# Altium project Brd_4_Sensor_Shield.PrjPcb
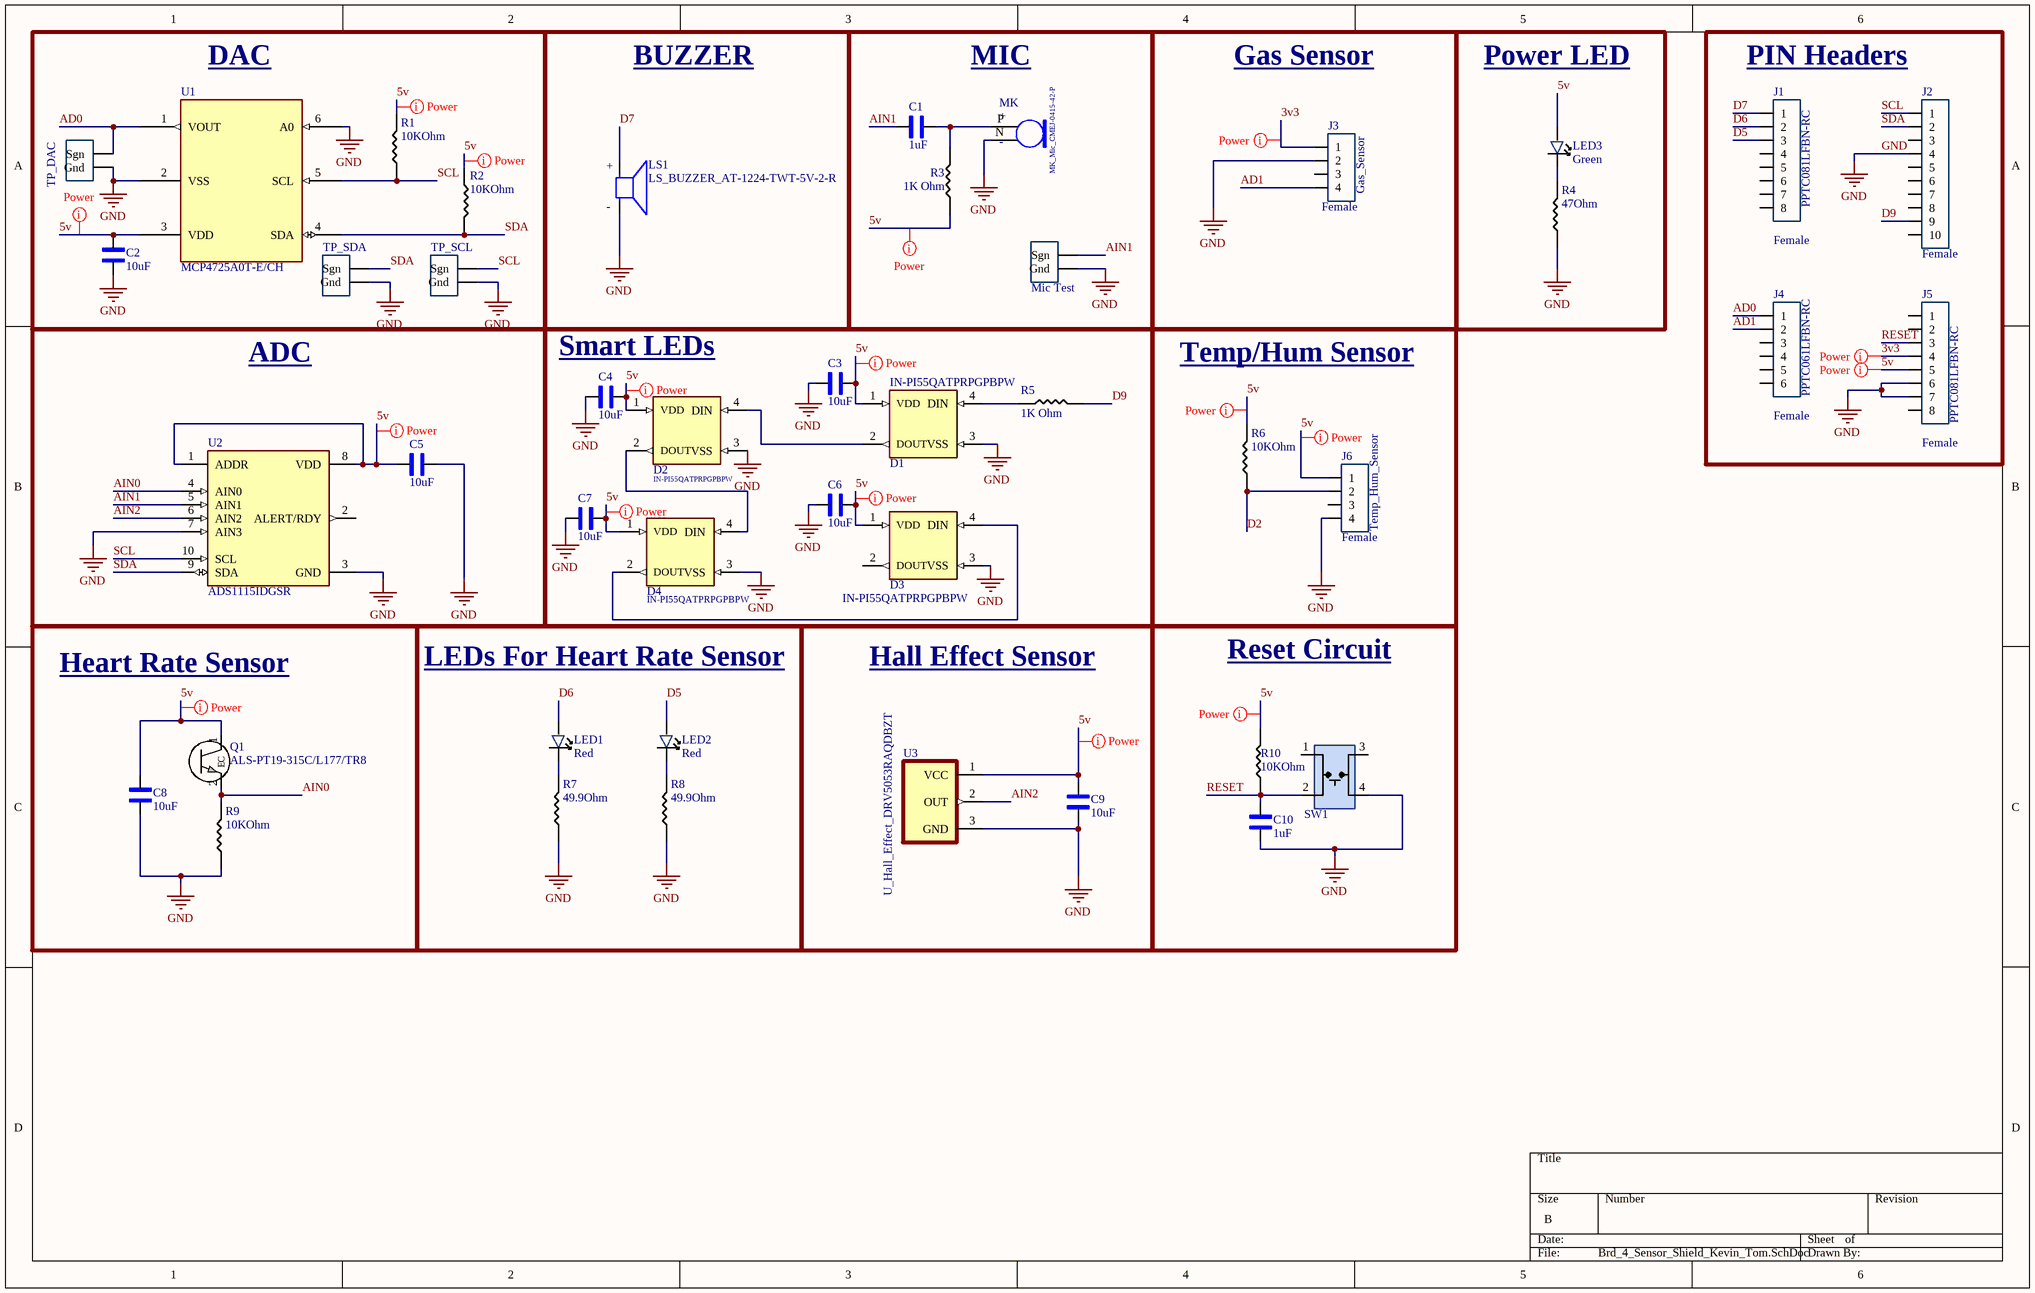
[diagram p0: Brd_4_Sensor_Shield_Kevin_Tom.SchDoc]
1 sheet, 44 parts. Net scope: global (net labels, ports and power ports of the same name join across sheets).
Board file: Brd_4_Sensor_Shield_Kevin_Tom.PcbDoc

## Sheet Brd_4_Sensor_Shield_Kevin_Tom.SchDoc
size B; SheetNumber: 1; SheetTotal: 1

### Parts
C1  1uF  [1206_Passive_Capacitor]
C2  10uF  [1206_Passive_Capacitor]
C3  10uF  [1206_Passive_Capacitor]
C4  10uF  [1206_Passive_Capacitor]
C5  10uF  [1206_Passive_Capacitor]
C6  10uF  [1206_Passive_Capacitor]
C7  10uF  [1206_Passive_Capacitor]
C8  10uF  [1206_Passive_Capacitor]
C9  10uF  [1206_Passive_Capacitor]
C10  1uF  [1206_Passive_Capacitor]
D1  IN-PI55QATPRPGPBPW  [SERIAL_LED]
D2  IN-PI55QATPRPGPBPW  [SERIAL_LED]
D3  IN-PI55QATPRPGPBPW  [SERIAL_LED]
D4  IN-PI55QATPRPGPBPW  [SERIAL_LED]
J1  PPTC081LFBN-RC  value Female  [8_PIN_ARDUINO_100MIL]
J2  value Female  [10_PIN_ARDUINO_100MIL]  (hidden comment: PPTC101LFBN-RC)
J3  Gas_Sensor  value Female  [4_PIN_100MIL]
J4  PPTC061LFBN-RC  value Female  [6_PIN_ARDUINO_100mil]
J5  PPTC081LFBN-RC  value Female  [8_PIN_ARDUINO_100MIL]
J6  Temp_Hum_Sensor  value Female  [4_PIN_100MIL]
LED1  Red  [LED_1206]
LED2  Red  [LED_1206]
LED3  Green  [LED_1206]
LS1  LS_BUZZER_AT-1224-TWT-5V-2-R  [XDCR_AT-1224-TWT-5V-2-R]
Mic_Test  10x Probe TP  [TP10x_Probe]  (value not drawn)
MK  MK_Mic_CMEJ-0415-42-P  [MK_MIC_CMEJ-0415-42-P]
Q1  ALS-PT19-315C/L177/TR8  [LED_77/TR8_EVE]
R1  value 10KOhm  [1206_Passive_Resitor]  (hidden comment: 10k)
R2  value 10KOhm  [1206_Passive_Resitor]  (hidden comment: 10k)
R3  value 1K Ohm  [1206_Passive_Resitor]  (hidden comment: 1k)
R4  value 47Ohm  [1206_Passive_Resitor]  (hidden comment: 47 Ohms)
R5  value 1K Ohm  [1206_Passive_Resitor]  (hidden comment: 1k)
R6  value 10KOhm  [1206_Passive_Resitor]  (hidden comment: 10k)
R7  value 49.9Ohm  [0402_Passive_Resistor]  (hidden comment: 50 Ohms)
R8  value 49.9Ohm  [0402_Passive_Resistor]  (hidden comment: 50 Ohms)
R9  value 10KOhm  [1206_Passive_Resitor]  (hidden comment: 10k)
R10  value 10KOhm  [1206_Passive_Resitor]  (hidden comment: 10k)
SW1  TL3305AF160QG  [Switch_JLC]  (value not drawn)
TP2  TP_DAC  [TP10x_Probe]
TP3  TP_SDA  [TP10x_Probe]
TP4  TP_SCL  [TP10x_Probe]
U1  MCP4725A0T-E/CH  [DAC_MCP4725A0T-E/CH]
U2  ADS1115IDGSR  [ADC_ADS1115IDGSR]
U3  U_Hall_Effect_DRV5053RAQDBZT  [U_Hall_Effect_SOT95P237X112-3N]

### Blocks framed on the sheet
DAC: C2 R1 R2 TP2-TP4 U1
BUZZER: LS1
MIC: C1 Mic_Test MK R3
Gas Sensor: J3
Power LED: LED3 R4
PIN Headers: J1 J2 J4 J5
ADC: C5 U2
Smart LEDs: C3 C4 C6 C7 D1-D4 R5
Temp/Hum Sensor: J6 R6
Heart Rate Sensor: C8 Q1 R9
LEDs For Heart Rate Sensor: LED1 LED2 R7 R8
Hall Effect Sensor: C9 U3
Reset Circuit: C10 R10 SW1

### Nets
GND: C2.1 C3.2 C4.2 C5.1 C6.2 C7.2 C8.2 C9.2 C10.1 D1.3(VSS) D2.3(VSS) D3.3(VSS) D4.3(VSS) J2.4 J3.2 J5.6 J5.7 J6.4 LS1.N Mic_Test.2(Gnd) MK.N(GND) R4.1 R7.1 R8.1 R9.1 SW1.4 TP2.2(Gnd) TP3.2(Gnd) TP4.2(Gnd) U1.2(VSS) U1.6(A0) U2.3(GND) U2.7(AIN3) U3.3(GND)
3v3: J3.1 J5.4
5v: C2.2 C3.1 C4.1 C5.2 C6.1 C7.1 C8.1 C9.1 D1.1(VDD) D2.1(VDD) D3.1(VDD) D4.1(VDD) J5.5 J6.1 LED3.1 Q1.1(C) R1.2 R2.1 R3.1 R6.2 R10.2 U1.3(VDD) U2.1(ADDR) U2.8(VDD) U3.1(VCC)
AD0: J4.1 TP2.1(Sgn) U1.1(VOUT)
AD1: J3.4 J4.2
AIN0: Q1.2(E) R9.2 U2.4(AIN0)
AIN1: C1.1 Mic_Test.1(Sgn) U2.5(AIN1)
AIN2: U2.6(AIN2) U3.2(OUT)
D2: J6.2 R6.1
D5: J1.3 LED2.1
D6: J1.2 LED1.1
D7: J1.1 LS1.P
D9: J2.9 R5.2
RESET: C10.2 J5.3 R10.1 SW1.2
SCL: J2.1 R1.1 TP4.1(Sgn) U1.5(SCL) U2.10(SCL)
SDA: J2.2 R2.2 TP3.1(Sgn) U1.4(SDA) U2.9(SDA)
NetC1_2: C1.2 MK.P(OUTPUT) R3.2
NetD1_2: D1.2(DOUT) D2.4(DIN)
NetD1_4: D1.4(DIN) R5.1
NetD2_2: D2.2(DOUT) D4.4(DIN)
NetD3_4: D3.4(DIN) D4.2(DOUT)
NetLED1_2: LED1.2 R7.2
NetLED2_2: LED2.2 R8.2
NetLED3_2: LED3.2 R4.2

Not connected (* = marked no-connect by the designer): D3 2(DOUT); J1 4 5 6 7 8; J2 3 5 6 7 8 10; J3 3; J4 3 4 5 6; J5 1 2 8; J6 3; SW1 1 3; U2 2(ALERT/RDY)

### Layout directives
rule Width Constraint [Pref Width = 20mil    Min Width = 20mil    Max Width = 100mil]: 3v3, 5v

### Notes on the sheet
- (in symbol LS_BUZZER_AT-1224-TWT-5V-2-R) +; -
- (in symbol MK_Mic_CMEJ-0415-42-P) +; -

### Library data of the parts
C1 C10 = C_1uF_1206: MULTILAYER CERAMIC CAPACITORS MLCC - SMD/SMT 1UF 50V 1206 ROHS; MFR Part #: CL31B105KBHNNNE; Type: Basic; Digikey Link: https://www.digikey.com/product-detail/en/C1206C105M4RACTU/399-8150-1-ND/3471873/?itemSeq=304982366; Digikey Part: 399-8150-1-ND; LCSC Part#: C1848; Value: 1uF
C2-C9 = C_10uF_1206: 10uF ±10% 50V X5R 1206 Multilayer Ceramic Capacitors MLCC - SMD/SMT RoHS; MFR Part #: CL31A106KBHNNNE; Type: Basic; LCSC Part#: C13585; Datasheet: https://datasheet.lcsc.com/lcsc/1810221112_Samsung-Electro-Mechanics-CL31A106KBHNNNE_C13585.pdf; Value: 10uF
D1-D4 = LED_Smart_5050: Digital Series Cascade LED; DigiKey: https://www.digikey.com/product-detail/en/inolux/IN-PI55QATPRPGPBPW-60/1830-1209-1-ND/9681289; Parameter 1: *
J1 J5 = JF_8_PIN_FEMALE_ARDUINO: 8 Position Header Connector 0.100" (2.54mm) Through Hole Tin; Digikey Link: https://www.digikey.com/product-detail/en/PPTC081LFBN-RC/S7006-ND/810147/?itemSeq=304982354; Digikey Part: S7006-ND; Type: Extended; LCSC Part#: C27438
J2 = JF_10_PIN_FEMALE_ARDUINO: 10 Position Header Connector 0.100" (2.54mm) Through Hole Tin; Digikey Link: https://www.digikey.com/product-detail/en/PPTC101LFBN-RC/S7008-ND/810149/?itemSeq=304982352; Digikey Part: S7008-ND; LCSC Part#: C225507; Type: Extended
J3 J6 = JF_4_PIN_FEMALE_ARDUINO: 4 Position Header Connector 0.100" (2.54mm) Through Hole Tin; Digikey Link: https://www.digikey.com/product-detail/en/PPTC061LFBN-RC/S7004-ND/810145/?itemSeq=304982353; Digikey Part: S7004-ND; LCSC Part#: C40877; Type: Extended
J4 = JF_6_PIN_FEMALE_ARDUINO: 6 Position Header Connector 0.100" (2.54mm) Through Hole Tin; Digikey Link: https://www.digikey.com/product-detail/en/PPTC061LFBN-RC/S7004-ND/810145/?itemSeq=304982353; Digikey Part: S7004-ND; LCSC Part#: C40877; Type: Extended
LED1 LED2 = LED_RED_1206: Red 621~631nm 1206 Light Emitting Diodes (LED) RoHS; MFR Part #: 15-21/R6C-FQ1R1B/2T; Type: Extended; LCSC Part#: C93133; Datasheet: https://datasheet.lcsc.com/szlcsc/1811151241_Everlight-Elec-15-21-R6C-FQ1R1B-2T_C93133.pdf; Value: Red
LED3 = LED_GREEN_1206: Green 513~528nm 1206 Light Emitting Diodes (LED) RoHS; MFR Part #: SZYY1206G; Type: Extended; LCSC Part#: C434439; Datasheet: https://datasheet.lcsc.com/lcsc/2006301532_Yongyu-Photoelectric-SZYY1206G_C434439.pdf; Value: Green
LS1 = LS_BUZZER_AT-1224-TWT-5V-2-R: AUDIO TRANSDUCER 5 VP-P 87 DB 2400 HZ; MF: PUI Audio,; Check_prices: https://www.snapeda.com/parts/AT-1224-TWT-5V-2-R/PUI%20Audio,%20Inc./view-part/453710/?ref=eda; Purchase-URL: https://pricing.snapeda.com/search/part/AT-1224-TWT-5V-2-R/?ref=eda; SnapEDA_Link: https://www.snapeda.com/parts/AT-1224-TWT-5V-2-R/PUI%20Audio,%20Inc./view-part/453710/?ref=snap; Value: *; MP: AT-1224-TWT-5V-2-R; Package: PUI Audio,; Price: None; Availability: In Stock; MFR Part #: AT-1224-TWT-5V-2-R; Datasheet: https://www.puiaudio.com/media/SpecSheet/AT-1224-TWT-5V-2-R.pdf
Mic_Test TP2-TP4 = TP_10x_Probe: Test Point 300 mil centers
MK = MK_Mic_CMEJ-0415-42-P: 0.4mm OMNIDIRECTIONAL MIC; MF: CUI Devices; Digi-Key_Part_Number: 102-6542-ND; Package: CUI Inc.; CUI_purchase_URL: https://www.cuidevices.com/product/audio/microphones/electret-condenser-microphones/cmej-0415-42-p?utm_source=snapeda.com&utm_medium=referral&utm_campaign=snapedaBOM; MFR Part #: CMEJ-0415-42-P; Digi-Key_Purchase_URL: https://www.digikey.com/product-detail/en/cui-devices/CMEJ-0415-42-P/102-6542-ND/10253451?utm_source=snapeda&utm_medium=aggregator&utm_campaign=symbol; SnapEDA_Link: https://www.snapeda.com/parts/CMEJ-0415-42-P/CUI%20Devices/view-part/3625885/?ref=snap; Datasheet: https://www.cuidevices.com/product/resource/cmej-0415-42-p.pdf
Q1 = Q_Phototransistor: Ambient Light Sensor; Type: Extended; Datasheet: https://www.everlight.com/file/ProductFile/201407061531031645.pdf; MFR Part #: ALS-PT19-315C/L177/TR8; LCSC Part#: C146233
R1 R2 R6 R9 R10 = R_10KOhm_1206: 10 kOhms ±5% 0.25W, 1/4W Chip Resistor 1206 (3216 Metric) Automotive AEC-Q200 Thick Film; Digikey Link: https://www.digikey.com/product-detail/en/RMCF1206JT300R/RMCF1206JT300RCT-ND/1942776/?itemSeq=304982374; Digikey Part: RMCF1206JT300RCT-ND; LCSC Part#: C17902; Type: Basic
R3 R5 = R_1K_1206: CHIP RESISTOR - SURFACE MOUNT 1KOHMS ±1% 1/4W 1206 ROHS; MFR Part #: 1206W4F1001T5; Digikey Link: https://www.digikey.com/product-detail/en/RNCP1206FTD1K00/RNCP1206FTD1K00CT-ND/2240675/?itemSeq=304982373; Digikey Part: RNCP1206FTD1K00CT-ND; LCSC Part#: C4410; Type: Basic
R4 = R_47Ohm_1206: 47Ω ±5% 0.25W ±200ppm/℃ 1206 Chip Resistor - Surface Mount RoHS; MFR Part #: 1206W4J0470T5E; LCSC Part#: C25384; Type: Extended; Datasheet: https://datasheet.lcsc.com/lcsc/1811101020_UNI-ROYAL-Uniroyal-Elec-1206W4J0470T5E_C25384.pdf
R7 R8 = R_50Ohm_0402: CHIP RESISTOR - SURFACE MOUNT 49.9OHMS ±1% 1/16W 0402 ROHS; MFR Part #: 0402WGF499JTCE; Datasheet: https://datasheet.lcsc.com/szlcsc/Uniroyal-Elec-0402WGF499JTCE_C25120.pdf; LCSC Part#: C25120; Type: Basic
SW1 = SW_Push_Button_JLC: Tactile Switch SPST-NO Top Actuated Surface Mount; MFR Part #: C174049; LCSC Part#: C174049; Type: Extended
U1 = U_DAC_MCP4725A0T-E/CH: Voltage-Buffered 12 1 I2C SOT-23-6 Digital To Analog Converters (DACs) ROHS; MFR Part #: MCP4725A0T-E/CH; LCSC Part#: C144198; Datasheet: https://datasheet.lcsc.com/lcsc/1811151442_Microchip-Tech-MCP4725A0T-E-CH_C144198.pdf; Package: SOT-23-6L
U2 = U_ADC_ADS1115IDGSR: 16-Bit ADC with Integrated MUX, PGA, Comparator, Oscillator, and Reference 10-VSSOP -40 to 125; MFR Part #: ADS1115IDGSR; Package: MSOP-10 Texas Instruments; LCSC Part#: C37593; SnapEDA_Link: https://www.snapeda.com/parts/ADS1115IDGSR/Texas%20Instruments/view-part/?ref=snap; Type: Extended; Digi-Key_Purchase_URL: https://www.digikey.com/product-detail/en/texas-instruments/ADS1115IDGSR/296-38849-1-ND/5142969?utm_source=snapeda&utm_medium=aggregator&utm_campaign=symbol; Value: *
U3 = U_Hall_Effect_DRV5053RAQDBZT: SENSOR LINEAR ANALOG SOT23-3; MFR Part #: DRV5053RAQDBZT; Package: None; MP: DRV5053RAQDBZT; Datasheet: https://www.ti.com/lit/ds/symlink/drv5053.pdf?HQS=dis-dk-null-digikeymode-dsf-pf-null-wwe&ts=1648501609471&ref_url=https%253A%252F%252Fwww.ti.com%252Fgeneral%252Fdocs%252Fsuppproductinfo.tsp%253FdistId%253D10%2526gotoUrl%253Dhttps%253A%252F%252Fwww.ti.com%252Flit%252Fgpn%252Fdrv5053